# EAGLE design max3051_breadboard (EAGLE 9.4.2)
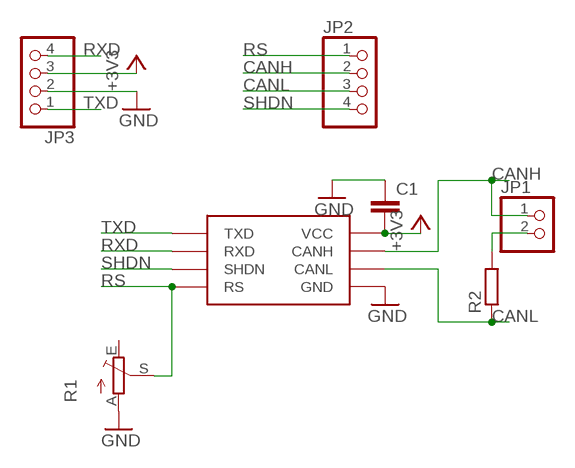
[diagram p0: schematic, sheet 1]

## Parts
C1  C-EUC0603  [C0603]
JP1  PINHD-1X2  [1X02]
JP2  PINHD-1X4  [1X04]
JP3  PINHD-1X4  [1X04]
R1  TRIM_EU-S64W  [S64W]
R2  R-EU_R0603  [R0603]
SOT1  MAX3051ESA  [SO-08]

## Nets
+3V3: C1.2 JP3.3 SOT1.3(VCC)
CANH: JP1.1 JP2.2 SOT1.7(CANH)
CANL: JP2.3 R2.1 SOT1.6(CANL)
GND: C1.1 JP3.2 R1.A SOT1.2(GND)
N$1: JP1.2 R2.2
RS: JP2.1 R1.S SOT1.8(RS)
RXD: JP3.4 SOT1.4(RXD)
SHDN: JP2.4 SOT1.5(SHDN)
TXD: JP3.1 SOT1.1(TXD)
Unconnected: R1.E

## Library data of the parts
C1 = rcl:C-EU: CAPACITOR, European symbol; SPICEPREFIX: C
JP1 = pinhead:PINHD-1X2: PIN HEADER
JP2 JP3 = pinhead:PINHD-1X4: PIN HEADER
R1 = pot:TRIM_EU-: POTENTIOMETER
R2 = rcl:R-EU_: RESISTOR, European symbol; SPICEPREFIX: R
SOT1 = maxim-openrobots:MAX3051

## Board
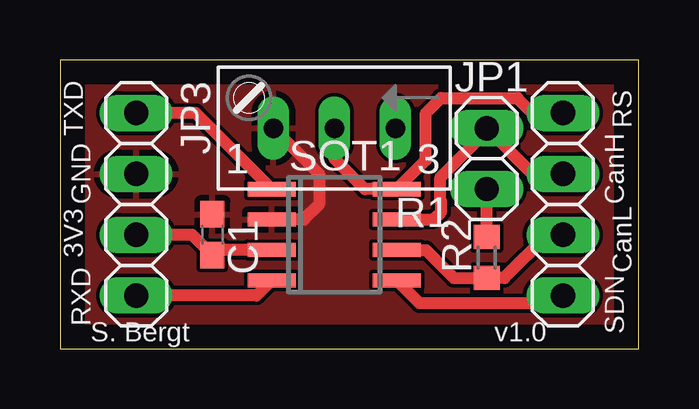
[diagram p1: board, top side]

Size 24.12 x 12.05 mm. Coordinates in mm from the lower left corner, seen from the top.
Outline: 0,0 24.12,0 24.12,12.05 0,12.05 0,0
Copper layers (1*16): Top 0.035mm / dielectric 1.5mm / Bottom 0.035mm
Design rules "default": minimum track width 6mil, minimum drill 0.35mm, track to track 6mil, track to pad 6mil, pad to pad 6mil, via to via 6mil, smd to smd 6mil, copper to edge 40mil, drill to drill 6mil, minimum pad ring 10mil, minimum via ring 8mil, stop-mask expansion 4mil, vias tented up to drill 0mil, thermal gap 10mil

### Footprints (pad centres in the part's own frame; a part is rotated, then mirrored left to right if it is on the bottom)
C0603 = smd 1.1 x 1: 1 -0.85,0; 2 0.85,0
1X02 = drill 1.016 long: 1 -1.27,0; 2 1.27,0
1X04 = drill 1.016 long: 1 -3.81,0; 2 -1.27,0; 3 1.27,0; 4 3.81,0
S64W = drill 0.813 long: A 2.54,1.27; E -2.54,1.27; S 0,1.27
R0603 = smd 1 x 1.1: 1 -0.85,0; 2 0.85,0
SO-08 = smd 0.6 x 2: 1 -1.905,-2.6; 2 -0.635,-2.6; 3 0.635,-2.6; 4 1.905,-2.6; 5 1.905,2.6; 6 0.635,2.6; 7 -0.635,2.6; 8 -1.905,2.6

### Placement (x,y rotation side)
C1  6.35,4.76 270 top
JP1  17.78,7.94 270 top
JP2  20.95,6.03 270 top
JP3  3.17,6.03 270 top
R1  11.43,10.48 180 top
R2  17.78,3.81 90 top
SOT1  11.43,4.76 270 top

### Tracks (layer width: path | path; a pad name or v marks a point on that pad's centre or on a via)
+3V3
  Top 0.508: JP3.3 5.5,4.76 C1.2 6.57,4.13 SOT1.3
CANH
  Top 0.508: SOT1.7 15.56,5.4 15.88,5.71 15.88,6.16 15.85,6.18 15.85,7.15 17.78,9.08 JP1.1 19.68,7.3 JP2.2
CANL
  Top 0.508: JP2.3 20.32,4.76 18.52,2.96 R2.1 16.41,2.96 15.24,4.13 SOT1.6
GND
  Top 0.508: 6.57,5.4 C1.1 | R1.A 10.79,7.3 10.79,6.03 10.16,5.4 SOT1.2
  pour Top: -1.27,0 25.4,0 25.4,13.34 -1.27,13.34
N$1
  Top 0.508: R2.2 JP1.2
RS
  Top 0.508: R1.S 11.43,7.94 12.7,6.67 SOT1.8 15.24,7.88 15.24,9.84 15.87,10.47 19.06,10.47 19.68,9.84 JP2.1
RXD
  Top 0.508: SOT1.4 8.2,2.22 JP3.4
SHDN
  Top 0.508: SOT1.5 14.98,1.91 20.64,1.91 JP2.4
TXD
  Top 0.508: SOT1.1 5.66,9.84 JP3.1

### Text on the board
tNames: TXD | RS | GND | CanH | 3V3 | CanL | RXD | SDN | S. Bergt | v1.0